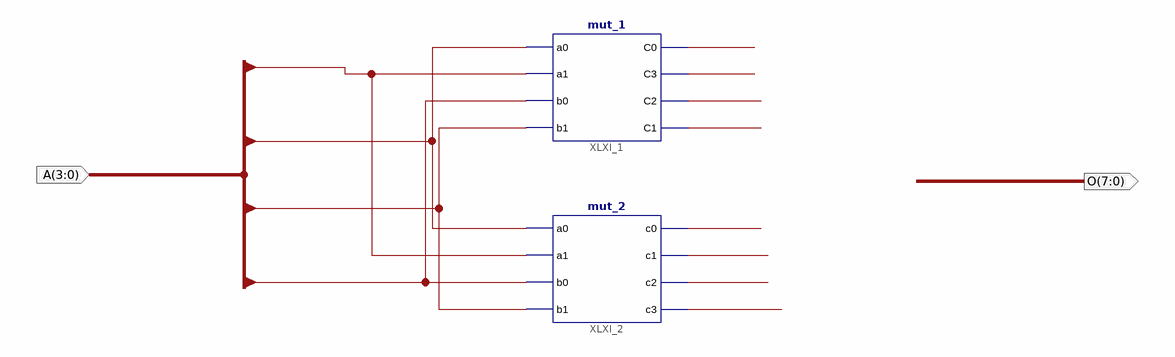
[diagram p0: schematic sheet 1]
// Xilinx ISE schematic MUTI.sch (kintex7) as structural Verilog: 2 symbols, 2 ports
module MUTI (
  input  [3:0] A,
  output [7:0] O
);

  mut_1 XLXI_1 (.a0(A[2]), .a1(A[3]), .b0(A[0]), .b1(A[1]), .C0(O[4]), .C3(O[7]), .C2(O[6]), .C1(O[5]));
  mut_2 XLXI_2 (.a0(A[2]), .a1(A[3]), .b0(A[0]), .b1(A[1]), .c0(O[0]), .c1(O[1]), .c2(O[2]), .c3(O[3]));
endmodule
